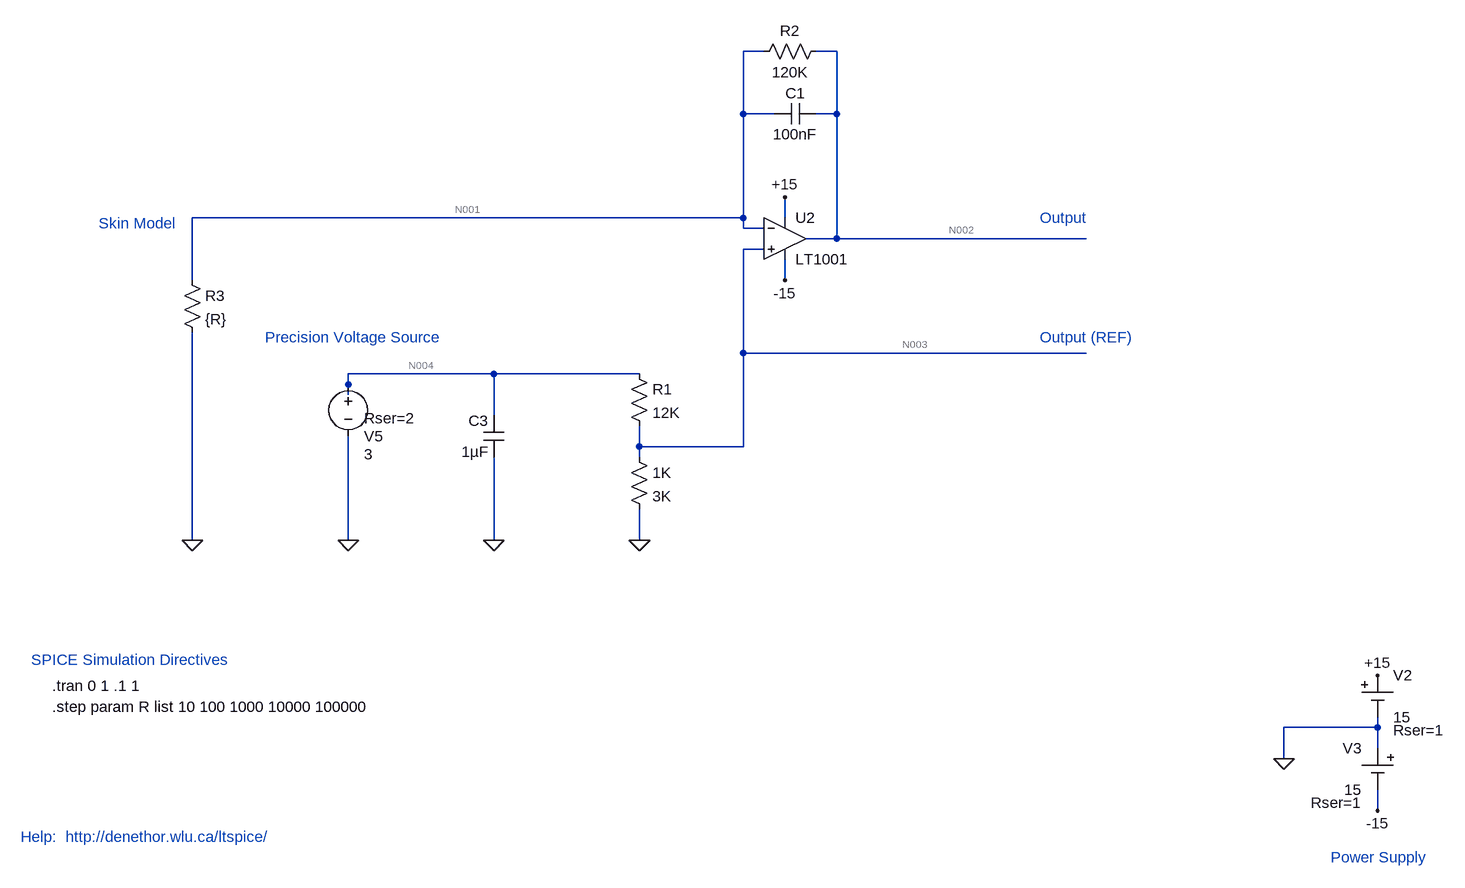
[diagram p0: schematic GSR11.asc]
GSR11.asc, the LTspice schematic file:
Version 4
SHEET 1 1356 1016
WIRE -208 -352 -240 -352
WIRE -96 -352 -128 -352
WIRE -240 -256 -240 -352
WIRE -192 -256 -240 -256
WIRE -96 -256 -96 -352
WIRE -96 -256 -128 -256
WIRE -240 -96 -240 -256
WIRE -240 -96 -1088 -96
WIRE -176 -96 -176 -128
WIRE -240 -80 -240 -96
WIRE -208 -80 -240 -80
WIRE -96 -64 -96 -256
WIRE -96 -64 -144 -64
WIRE 288 -64 -96 -64
WIRE -208 -48 -240 -48
WIRE -1088 0 -1088 -96
WIRE -176 0 -176 -32
WIRE -240 112 -240 -48
WIRE 288 112 -240 112
WIRE -624 144 -848 144
WIRE -400 144 -624 144
WIRE -848 160 -848 144
WIRE -848 176 -848 160
WIRE -624 208 -624 144
WIRE -400 256 -400 224
WIRE -240 256 -240 112
WIRE -240 256 -400 256
WIRE -400 272 -400 256
WIRE -1088 400 -1088 80
WIRE -848 400 -848 240
WIRE -624 400 -624 272
WIRE -400 400 -400 352
WIRE 736 688 736 672
WIRE 736 688 592 688
WIRE 736 720 736 688
WIRE 592 736 592 688
WIRE 736 816 736 784
FLAG 736 608 +15
FLAG 736 816 -15
FLAG 592 736 0
FLAG -176 0 -15
FLAG -176 -128 +15
FLAG -400 400 0
FLAG -624 400 0
FLAG -848 400 0
FLAG -1088 400 0
SYMBOL Opamps\\LT1001 -176 -128 R0
SYMATTR InstName U2
SYMBOL Misc\\cell 736 608 R0
WINDOW 123 0 0 Left 2
WINDOW 39 24 84 Left 2
SYMATTR SpiceLine Rser=1
SYMATTR InstName V2
SYMATTR Value 15
SYMBOL Misc\\cell 736 720 M0
WINDOW 123 0 0 Left 2
WINDOW 39 24 84 Left 2
SYMATTR SpiceLine Rser=1
SYMATTR InstName V3
SYMATTR Value 15
SYMBOL res -112 -368 R90
WINDOW 0 0 56 VBottom 2
WINDOW 3 32 56 VTop 2
SYMATTR InstName R2
SYMATTR Value 120K
SYMBOL cap -128 -272 R90
WINDOW 0 0 32 VBottom 2
WINDOW 3 32 32 VTop 2
SYMATTR InstName C1
SYMATTR Value 100nF
SYMBOL res -416 128 R0
SYMATTR InstName R1
SYMATTR Value 12K
SYMBOL res -416 256 R0
SYMATTR InstName 1K
SYMATTR Value 3K
SYMBOL cap -608 272 R180
WINDOW 0 24 56 Left 2
WINDOW 3 24 8 Left 2
SYMATTR InstName C3
SYMATTR Value 1µF
SYMBOL voltage -848 144 R0
WINDOW 0 24 96 Left 2
WINDOW 3 24 124 Left 2
WINDOW 39 24 68 Left 2
WINDOW 123 0 0 Left 2
SYMATTR InstName V5
SYMATTR Value 3
SYMATTR SpiceLine Rser=2
SYMBOL res -1104 -16 R0
SYMATTR InstName R3
SYMATTR Value {R}
TEXT -1352 856 Left 2 ;Help:  http://denethor.wlu.ca/ltspice/
TEXT -1336 584 Left 2 ;SPICE Simulation Directives
TEXT -1304 624 Left 2 !.tran 0 1 .1 1
TEXT -1232 -88 Left 2 ;Skin Model
TEXT -976 88 Left 2 ;Precision Voltage Source
TEXT -1304 656 Left 2 !.step param R list 10 100 1000 10000 100000
TEXT 216 -96 Left 2 ;Output
TEXT 664 888 Left 2 ;Power Supply
TEXT 216 88 Left 2 ;Output (REF)

The netlist it stands for:
* GSR11.asc
XU2 N003 N001 +15 -15 N002 LT1001  ; pins In+ In- V+ V- OUT
V2 +15 0 15 Rser=1
V3 0 -15 15 Rser=1
R2 N002 N001 120K
C1 N002 N001 100nF
R1 N004 N003 12K
R§1K N003 0 3K
C3 0 N004 1µF
V5 N004 0 3 Rser=2
R3 N001 0 {R}
* Help:  http://denethor.wlu.ca/ltspice/
* SPICE Simulation Directives
.tran 0 1 .1 1
* Skin Model
* Precision Voltage Source
.step param R list 10 100 1000 10000 100000
* Output
* Power Supply
* Output (REF)
.lib LTC.lib
.backanno
.end

* Results of the author's LTspice run, read from the files saved beside the schematic
* Operating Point (first step), zero values left out:
*   r = 10 
*   V(n001) = 1.172 mV
*   V(n003) = 599.9 mV
*   V(+15) = 15 V
*   V(-15) = -15 V
*   V(n002) = 14.06 V
*   V(n004) = 3 V
*   I(R3) = 117.2 µA
*   I(1k) = 200 µA
*   I(R1) = 200 µA
*   I(R2) = 117.2 µA
*   I(V5) = -200 µA
*   I(V3) = -2.195 mA
*   I(V2) = -2.305 mA
*   Ix(u2:1) = 8.085 nA
*   Ix(u2:2) = -8.083 nA
*   Ix(u2:3) = 2.305 mA
*   Ix(u2:4) = -2.195 mA
*   Ix(u2:5) = -117.2 µA
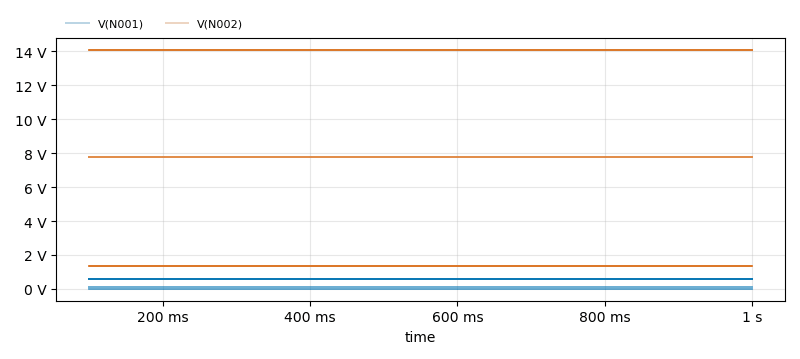
[diagram p1: Transient Analysis of GSR11.asc, plotted from the saved traces]
* Transient Analysis, 9 runs:
*   V(N001) [run 1]: min 1.172 mV, max 1.172 mV, average 1.172 mV, rms 1.172 mV, last 1.172 mV
*   V(N001) [run 2]: 11.71 mV at time=100 ms, 11.71 mV at time=100 ms, min 11.71 mV, max 11.71 mV
*   V(N001) [run 3]: min 11.71 mV, max 11.71 mV, average 11.71 mV, rms 11.71 mV, last 11.71 mV
*   V(N001) [run 4]: 116.2 mV at time=100 ms, 116.2 mV at time=100 ms, min 116.2 mV, max 116.2 mV
*   V(N001) [run 5]: min 116.2 mV, max 116.2 mV, average 116.2 mV, rms 116.2 mV, last 116.2 mV
*   V(N001) [run 6]: 599.9 mV at time=100 ms, 599.9 mV at time=100 ms, min 599.9 mV, max 599.9 mV
*   V(N001) [run 7]: min 599.9 mV, max 599.9 mV, average 599.9 mV, rms 599.9 mV, last 599.9 mV
*   V(N001) [run 8]: 599.9 mV at time=100 ms, 599.9 mV at time=100 ms, min 599.9 mV, max 599.9 mV
*   V(N002) [run 1]: min 14.06 V, max 14.06 V, average 14.06 V, rms 14.06 V, last 14.06 V
*   V(N002) [run 2]: 14.06 V at time=100 ms, 14.06 V at time=100 ms, min 14.06 V, max 14.06 V
*   V(N002) [run 3]: min 14.06 V, max 14.06 V, average 14.06 V, rms 14.06 V, last 14.06 V
*   V(N002) [run 4]: 14.06 V at time=100 ms, 14.06 V at time=100 ms, min 14.06 V, max 14.06 V
*   V(N002) [run 5]: min 14.06 V, max 14.06 V, average 14.06 V, rms 14.06 V, last 14.06 V
*   V(N002) [run 6]: 7.799 V at time=100 ms, 7.799 V at time=100 ms, min 7.799 V, max 7.799 V
*   V(N002) [run 7]: min 7.799 V, max 7.799 V, average 7.799 V, rms 7.799 V, last 7.799 V
*   V(N002) [run 8]: 1.32 V at time=100 ms, 1.32 V at time=100 ms, min 1.32 V, max 1.32 V